# Altium schematic sheet 3_ADSTM32-Peripheral.SchDoc
size A; SheetNumber: 4; SheetTotal: 4
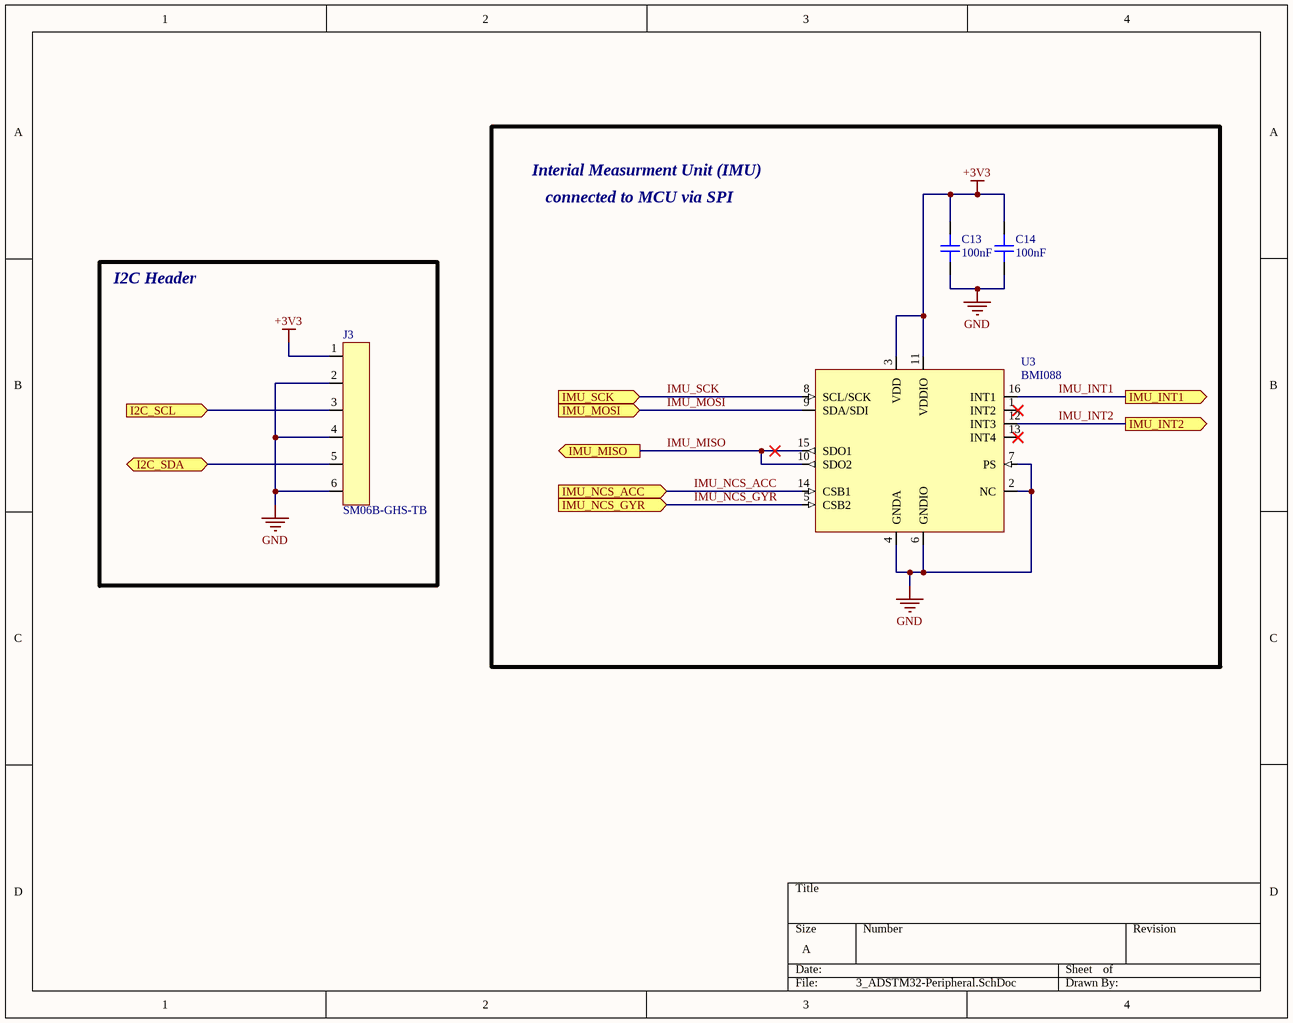
[diagram p0: 3_ADSTM32-Peripheral.SchDoc]

## Parts
C13  100nF  [CAP_0603]
C14  100nF  [CAP_0603]
J3  SM06B-GHS-TB  [SM06B-GHS-TB]
U3  BMI088  [BMI088]

## Blocks framed on the sheet
I2C Header: J3

## Ports
I2C_SCL (in), I2C_SDA (bidir), IMU_INT1 (out), IMU_INT2 (out), IMU_MISO (out), IMU_MOSI (in), IMU_NCS_ACC (in), IMU_NCS_GYR (in), IMU_SCK (in)

## Nets
+3V3: C13.2 C14.2 J3.1 U3.3(VDD) U3.11(VDDIO)
GND: C13.1 C14.1 J3.2 J3.4 J3.6 U3.2(NC) U3.4(GNDA) U3.6(GNDIO) U3.7(PS)
I2C_SCL: J3.3 ; port I2C_SCL
I2C_SDA: J3.5 ; port I2C_SDA
IMU_INT1: U3.16(INT1) ; port IMU_INT1
IMU_INT2: U3.12(INT3) ; port IMU_INT2
IMU_MISO: U3.10(SDO2) U3.15(SDO1) ; port IMU_MISO
IMU_MOSI: U3.9(SDA/SDI) ; port IMU_MOSI
IMU_NCS_ACC: U3.14(CSB1) ; port IMU_NCS_ACC
IMU_NCS_GYR: U3.5(CSB2) ; port IMU_NCS_GYR
IMU_SCK: U3.8(SCL/SCK) ; port IMU_SCK

Not connected (* = marked no-connect by the designer): U3 1(INT2)* 13(INT4)*

## Notes on the sheet
- Interial Measurment Unit (IMU)
- connected to MCU via SPI

## Library data of the parts
C13 C14 = CAP_0603: Capacitor SMD 0603; Manufacturer: *; Manufacturer Part Number: *; Distributor Link: *; LCSC: *; Rating: *; Dielectric: *
J3 = SM06B-GHS-TB: Header Connector 6 Position 1.25MM Pitch SMD Horizontal JST GH; Manufacturer: JST; Manufacturer Part Number: SM06B-GHS-TB
U3 = BMI088: Inertial Measurement Unit IMU 6-Axis LGA; Manufacturer: Bosch; Manufacturer Part Number: BMI088